# EAGLE schematic RHS2116_Test_Board (EAGLE 9.3.1)
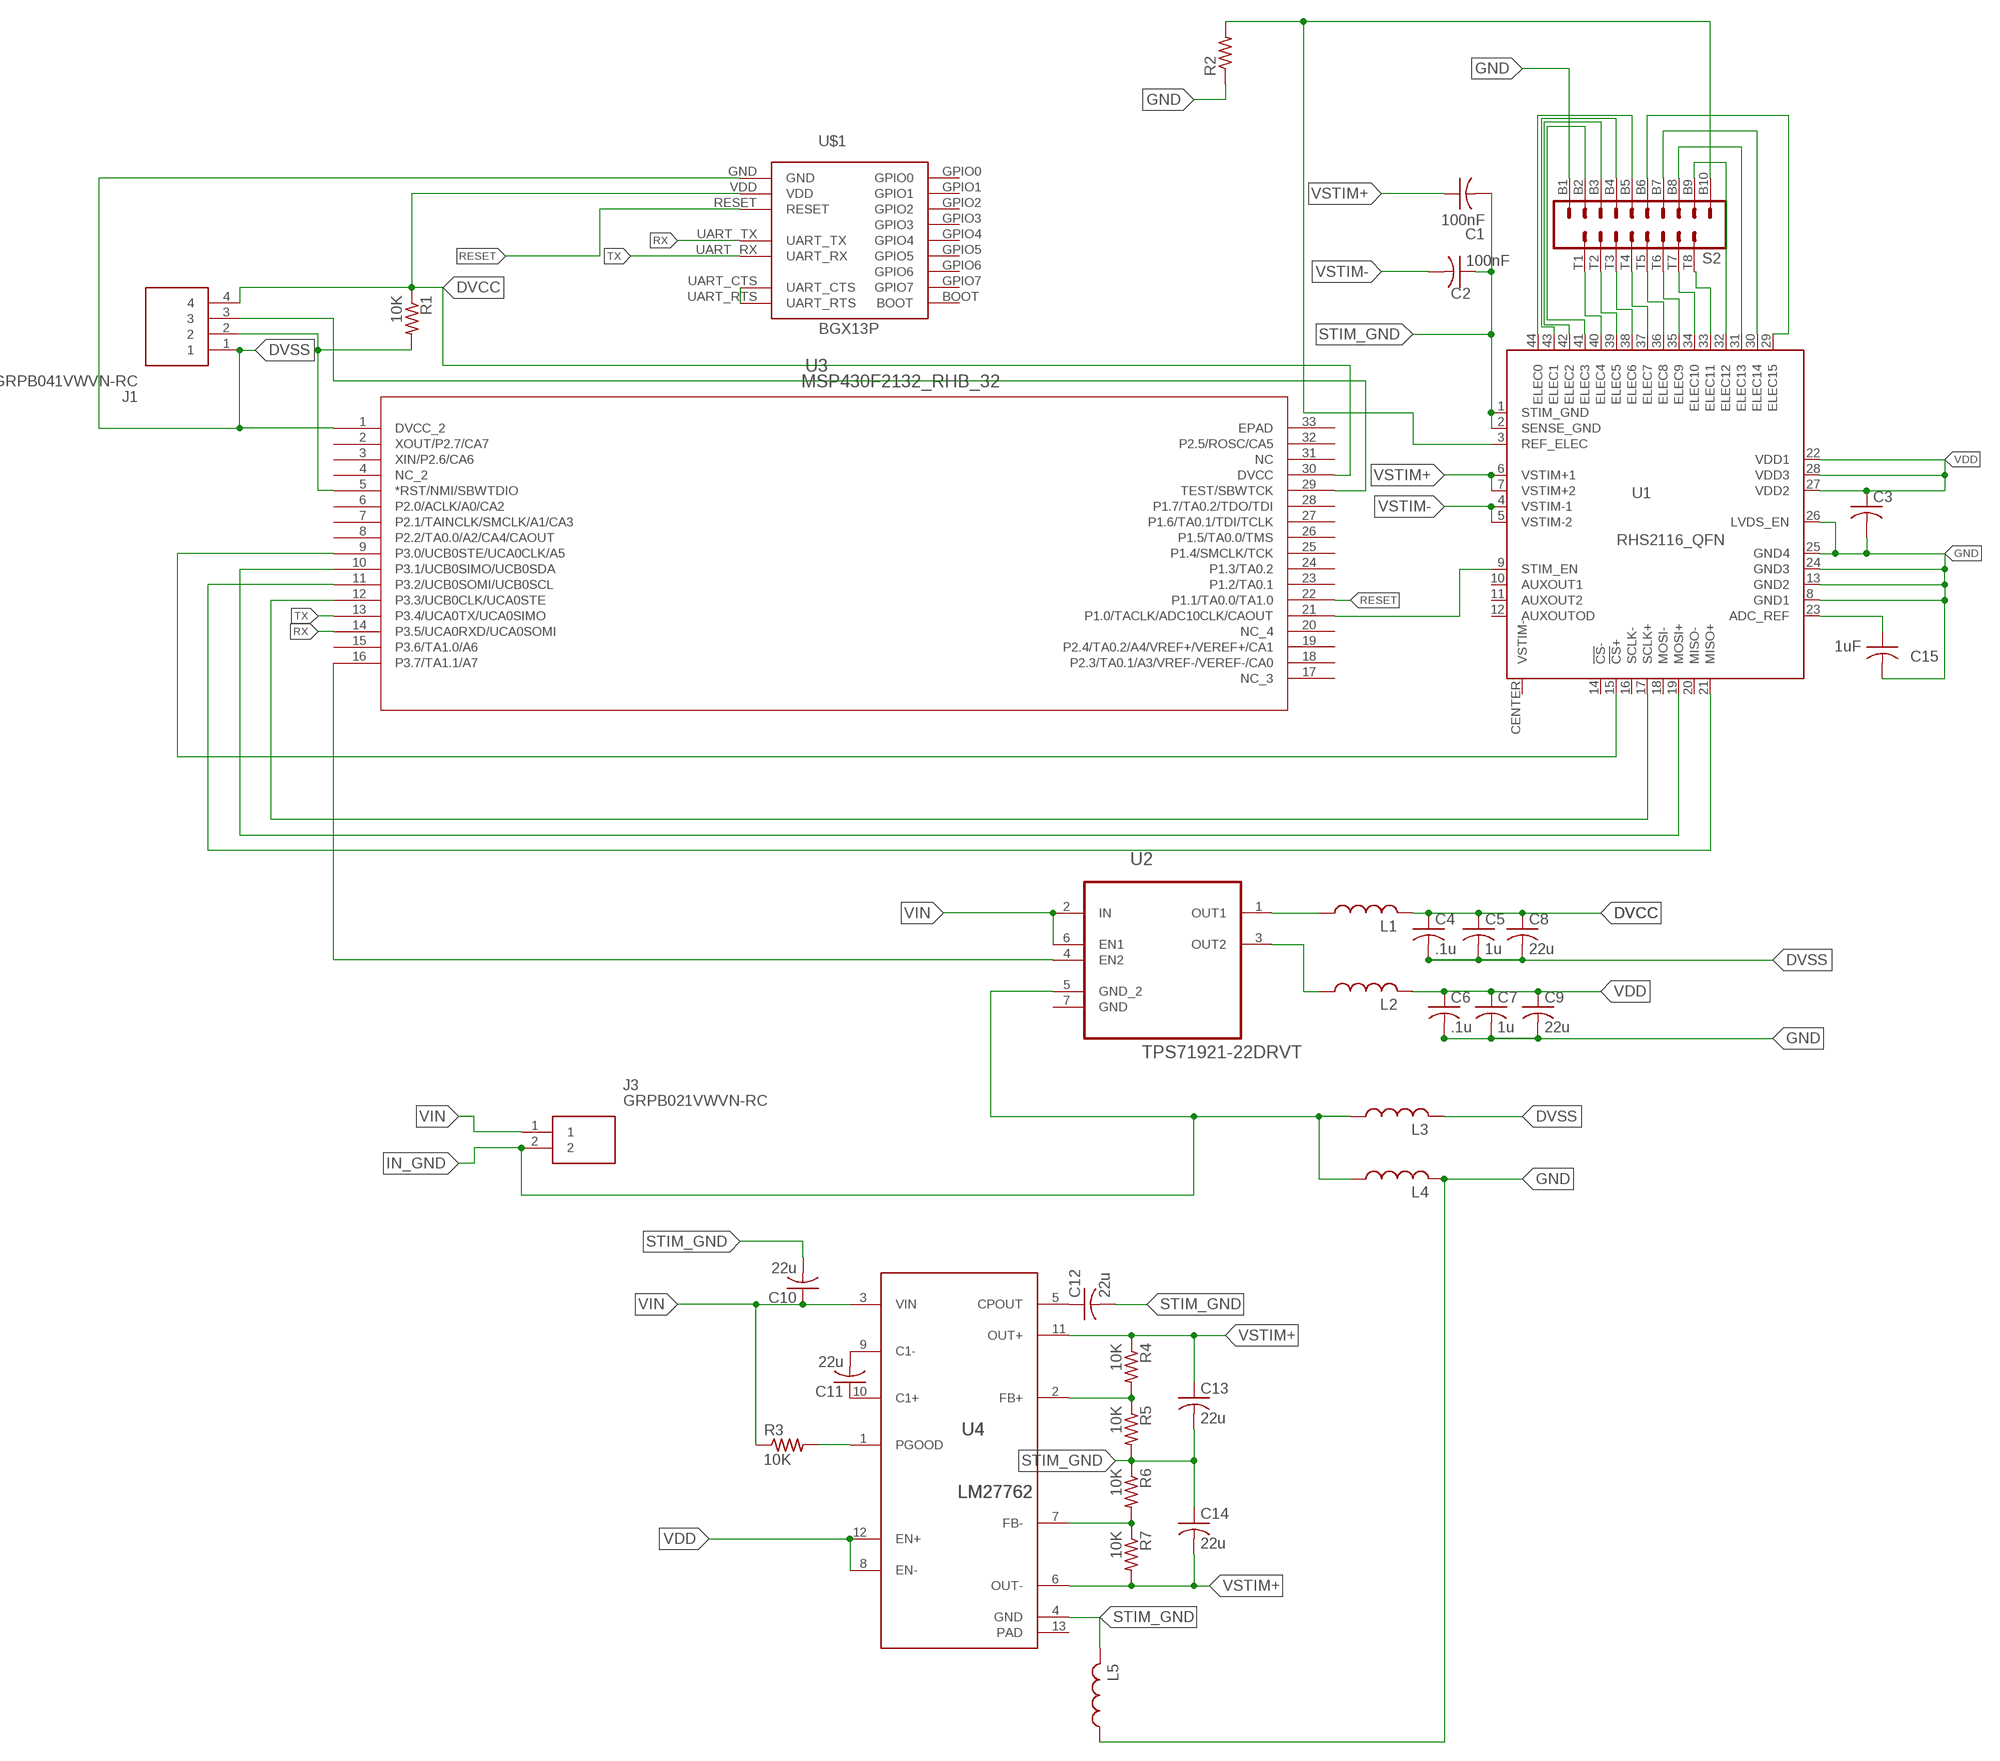
[diagram p0: schematic, sheet 1]

## Parts
C1  100nF  C-USC0402  [C0402]
C2  100nF  C-USC0402  [C0402]
C3  C-USC0402  [C0402]
C4  .1u  C-USC0402  [C0402]
C5  1u  C-USC0402  [C0402]
C6  .1u  C-USC0402  [C0402]
C7  1u  C-USC0402  [C0402]
C8  22u  C-USC0805  [C0805]
C9  22u  C-USC0805  [C0805]
C10  22u  C-USC0805  [C0805]
C11  22u  C-USC0805  [C0805]
C12  22u  C-USC0805  [C0805]
C13  22u  C-USC0805  [C0805]
C14  22u  C-USC0805  [C0805]
C15  1uF  C-USC0402  [C0402]
J1  GRPB041VWVN-RC  [HDRV4W55P0X127_1X4_508X214X420]
J3  GRPB021VWVN-RC  [HDRV2W40P0X127_1X2_254X214X400]
L1  L-USL0805  [L0805]
L2  L-USL0805  [L0805]
L3  L-USL0805  [L0805]
L4  L-USL0805  [L0805]
L5  L-USL0805  [L0805]
R1  10K  R-US_R0402  [R0402]
R2  R-US_R0402  [R0402]
R3  10K  R-US_R0402  [R0402]
R4  10K  R-US_R0402  [R0402]
R5  10K  R-US_R0402  [R0402]
R6  10K  R-US_R0402  [R0402]
R7  10K  R-US_R0402  [R0402]
S2  OMNETICS_A79041  [OMNETICS_A79041]
U1  RHS2116_QFN  [QFN44_7_X_7]
U2  TPS71921-22DRVT  [SON65P200X200X80-7N]
U3  MSP430F2132_RHB_32  [RHB32_3P45X3P45]
U4  LM27762  LM27762DSSR  [DSS0012B]
U$1  BGX13P  [BGX13P]

## Nets
DVCC: C4.1 C5.1 C8.1 J1.4 L1.2 R1.1 U3.30(DVCC) U$1.VDD
DVSS: C4.2 C5.2 C8.2 J1.1 L3.2 U3.1(DVCC_2) U$1.GND
GND: C3.2 C6.2 C7.2 C9.2 C15.2 L4.2 L5.1 R2.1 S2.B1 U1.8(GND1) U1.13(GND2) U1.24(GND3) U1.25(GND4) U1.26(LVDS_EN)
IN_GND: J3.2 L3.1 L4.1 U2.5(GND_2)
N$1: U1.17(SCLK+) U3.12(P3.3/UCB0CLK/UCA0STE)
N$2: U1.19(MOSI+) U3.10(P3.1/UCB0SIMO/UCB0SDA)
N$3: U1.21(MISO+) U3.11(P3.2/UCB0SOMI/UCB0SCL)
N$4: U1.15(!CS!+) U3.9(P3.0/UCB0STE/UCA0CLK/A5)
N$5: U1.9(STIM_EN) U3.21(P1.0/TACLK/ADC10CLK/CAOUT)
N$6: J1.2 R1.2 U3.5(*RST/NMI/SBWTDIO)
N$7: J1.3 U3.29(TEST/SBWTCK)
N$8: L1.1 U2.1(OUT1)
N$9: S2.B5 U1.44(ELEC0)
N$10: U2.4(EN2) U3.16(P3.7/TA1.1/A7)
N$11: S2.B4 U1.43(ELEC1)
N$12: S2.B3 U1.42(ELEC2)
N$13: S2.B2 U1.41(ELEC3)
N$14: S2.T1 U1.40(ELEC4)
N$15: S2.T2 U1.39(ELEC5)
N$16: S2.T3 U1.38(ELEC6)
N$17: S2.T4 U1.37(ELEC7)
N$18: S2.T5 U1.36(ELEC8)
N$19: S2.T6 U1.35(ELEC9)
N$20: S2.T7 U1.34(ELEC10)
N$21: S2.T8 U1.33(ELEC11)
N$22: S2.B6 U1.29(ELEC15)
N$23: S2.B7 U1.30(ELEC14)
N$24: R2.2 S2.B10 U1.3(REF_ELEC)
N$25: S2.B8 U1.31(ELEC13)
N$26: S2.B9 U1.32(ELEC12)
N$27: R3.2 U4.1(PGOOD)
N$28: C11.2 U4.9(C1-)
N$29: C11.1 U4.10(C1+)
N$30: C12.1 U4.5(CPOUT)
N$31: C15.1 U1.23(ADC_REF)
N$32: R4.2 R5.1 U4.2(FB+)
N$33: R6.2 R7.1 U4.7(FB-)
N$34: U$1.UART_CTS U$1.UART_RTS
RESET: U3.22(P1.1/TA0.0/TA1.0) U$1.RESET
RX: U3.14(P3.5/UCA0RXD/UCA0SOMI) U$1.UART_TX
STIM_GND: C1.2 C2.1 C10.2 C12.2 C13.2 C14.1 L5.2 R5.2 R6.1 U1.1(STIM_GND) U1.2(SENSE_GND) U4.4(GND)
TX: U3.13(P3.4/UCA0TX/UCA0SIMO) U$1.UART_RX
VDD: C3.1 C6.1 C7.1 C9.1 L2.1 L2.2 U1.22(VDD1) U1.27(VDD2) U1.28(VDD3) U2.3(OUT2) U4.8(EN-) U4.12(EN+)
VIN: C10.1 J3.1 R3.1 U2.2(IN) U2.6(EN1) U4.3(VIN)
VSTIM+: C1.1 C13.1 C14.2 R4.1 R7.2 U1.6(VSTIM+1) U1.7(VSTIM+2) U4.6(OUT-) U4.11(OUT+)
VSTIM-: C2.2 U1.4(VSTIM-1) U1.5(VSTIM-2)
Unconnected: U1.10(AUXOUT1) U1.11(AUXOUT2) U1.12(AUXOUTOD) U1.14(!CS!-) U1.16(SCLK-) U1.18(MOSI-) U1.20(MISO-) U2.7(GND) U3.2(XOUT/P2.7/CA7) U3.3(XIN/P2.6/CA6) U3.4(NC_2) U3.6(P2.0/ACLK/A0/CA2) U3.7(P2.1/TAINCLK/SMCLK/A1/CA3) U3.8(P2.2/TA0.0/A2/CA4/CAOUT) U3.15(P3.6/TA1.0/A6) U3.17(NC_3) U3.18(P2.3/TA0.1/A3/VREF-/VEREF-/CA0) U3.19(P2.4/TA0.2/A4/VREF+/VEREF+/CA1) U3.20(NC_4) U3.23(P1.2/TA0.1) U3.24(P1.3/TA0.2) U3.25(P1.4/SMCLK/TCK) U3.26(P1.5/TA0.0/TMS) U3.27(P1.6/TA0.1/TDI/TCLK) U3.28(P1.7/TA0.2/TDO/TDI) U3.31(NC) U3.32(P2.5/ROSC/CA5) U3.33(EPAD) U$1.BOOT U$1.GPIO0 U$1.GPIO1 U$1.GPIO2 U$1.GPIO3 U$1.GPIO4 U$1.GPIO5 U$1.GPIO6 U$1.GPIO7

## Power pins joined to a net without a drawn wire
PAD: U4.13(PAD)
VSTIM-: U1.CENTER(VSTIM-)

## Library data of the parts
C1-C5 C15 = resistor:C-US: CAPACITOR, American symbol
C6-C14 = rcl:C-US: CAPACITOR, American symbol
J1 = GRPB041VWVN-RC:GRPB041VWVN-RC: 4 Positions Header Connector 0.050" (1.27mm) Through Hole Gold Source: Datasheet <http://www.sullinscorp.com/drawings/71_GRPB___1VWVN-RC,_10957-C.pdf>; DESCRIPTION: 4 Positions Header Connector 0.050" (1.27mm) Through Hole Gold; HEIGHT: 4.2mm; MANUFACTURER_NAME: Sullins; MANUFACTURER_PART_NUMBER: GRPB041VWVN-RC
J3 = GRPB021VWVN-RC:GRPB021VWVN-RC: CONN HEADER .050" 2POS PCB GOLD Source: Datasheet <https://s3.amazonaws.com/catalogspreads-pdf/PAGE90-91 .050 MALE HDR ST RA SMT.pdf>; DESCRIPTION: CONN HEADER .050" 2POS PCB GOLD; HEIGHT: 4mm; MANUFACTURER_NAME: Sullins; MANUFACTURER_PART_NUMBER: GRPB021VWVN-RC
L1-L5 = rcl:L-US: INDUCTOR, American symbol
R1 R3-R7 = resistor:R-US_: RESISTOR, American symbol
R2 = adafruit:R-US_: RESISTOR, American symbol
S2 = RHS2000:OMNETICS_A79041
U1 = RHS2000:RHS2116: Intan Technologies RHS2116 chip
U2 = Texas Instruments_By_element14_Batch_1:TPS71921-22DRVT: Low-Dropout Linear Regulators; MPN: TPS71921-22DRVT; OC_FARNELL: 1735604; OC_NEWARK: 05R8708; PACKAGE: SON-6; SUPPLIER: Texas Instruments
U3 = MSP430F2132_VQFN:MSP430F2132_RHB_32; DATASHEETURL: httpwww.ti.comlitgpnMSP430F2132; FAMILY_NAME: 2 Series; GENERIC_PART_NUMBER: MSP430F2132; INDUSTRY_STD_PKG_TYPE: QFN; MANUFACTURER: Texas Instruments; MANUFACTURER_PART_NUMBER: msp430f2132_rhb_32; PACKAGE_DESIGNATOR: RHB; PIN_COUNT: 32; VENDOR: Texas Instruments
U4 = Texas Instruments_By_element14_Batch_1:LM27762DSSR; MANUFACTURER: Texas Instruments; PARTNUMBER: LM27762DSSR; REFDES: RefDes; TYPE: TYPE; VALUE: Value
U$1 = BGX13P:BGX13P